# EAGLE design FlashPanelV6_2 (EAGLE 7.7.0)
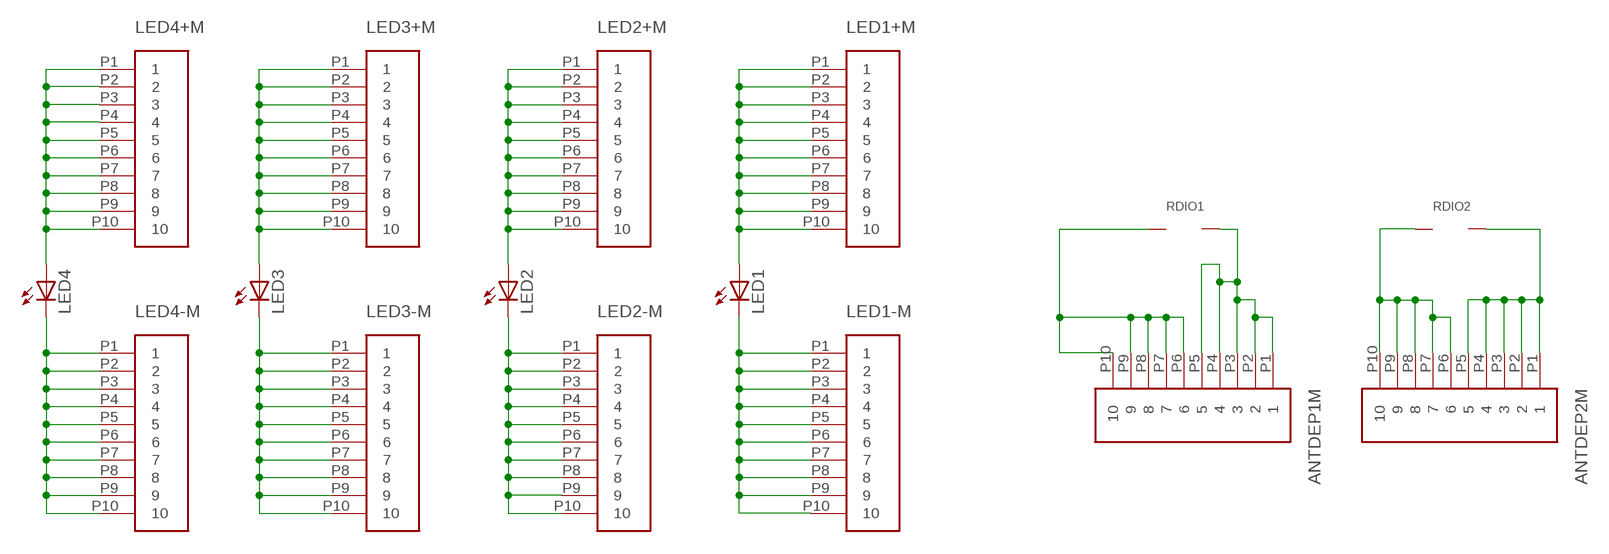
[diagram p0: schematic, sheet 1, part 1 of 2]
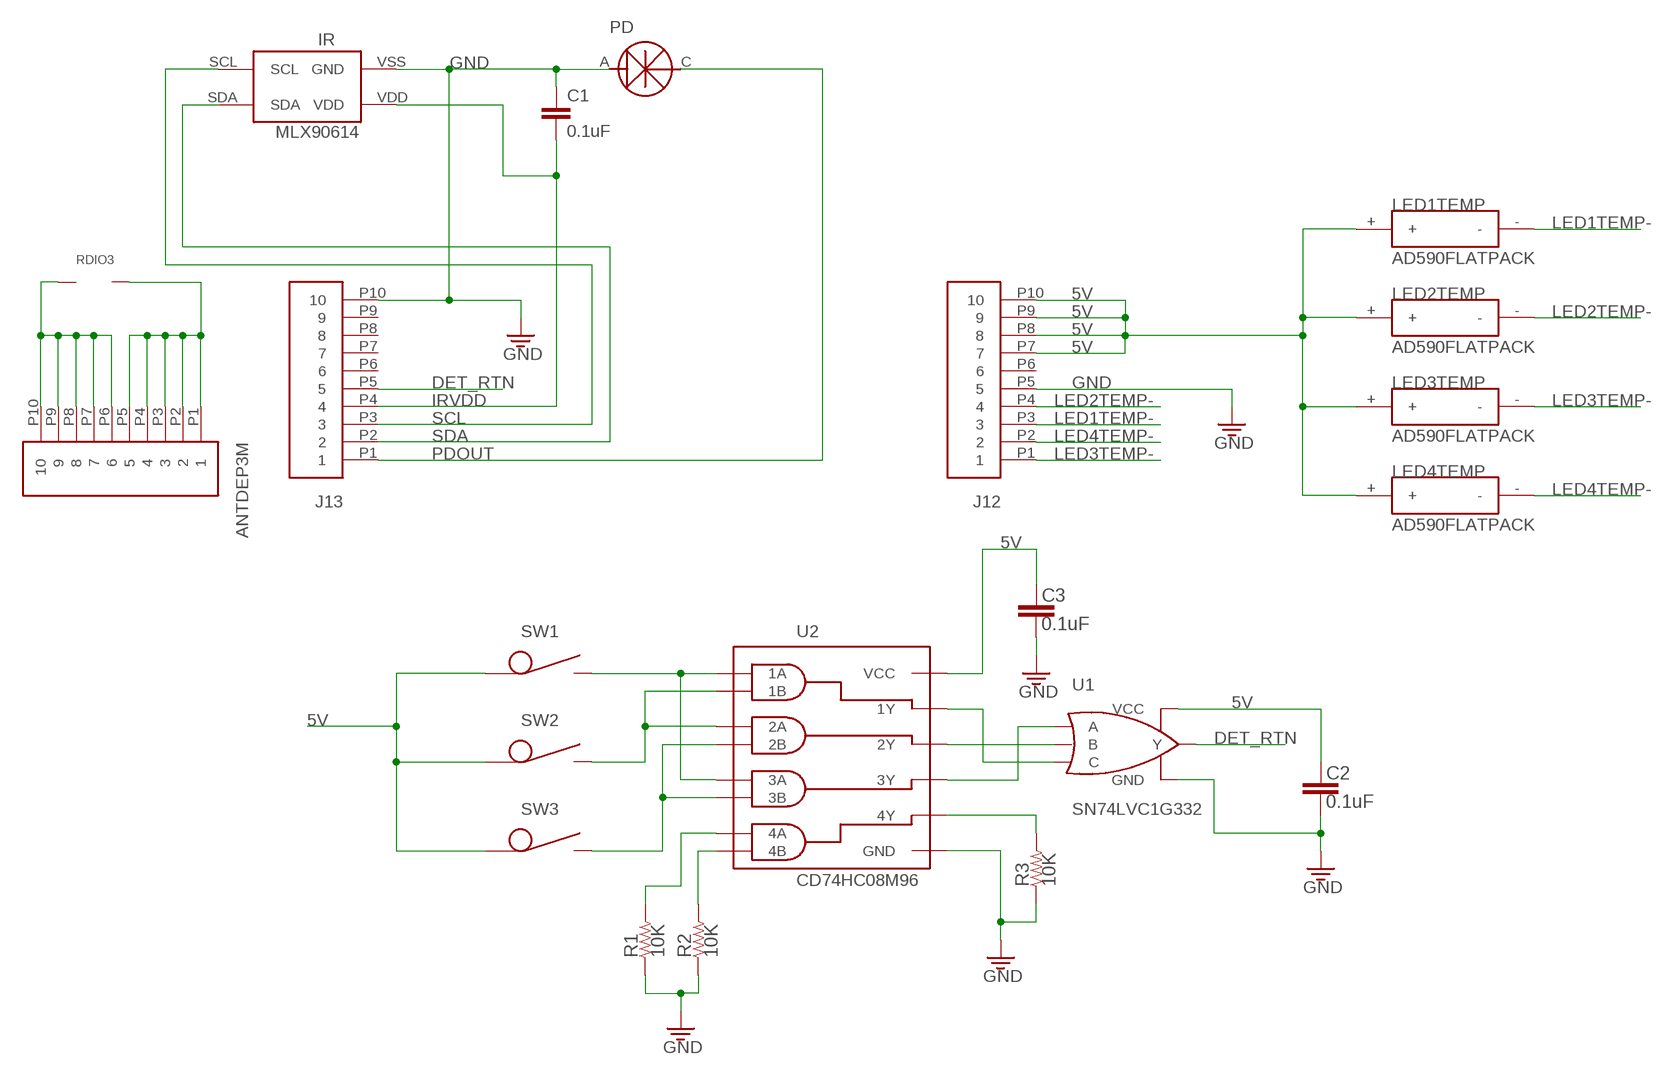
[diagram p1: schematic, sheet 1, part 2 of 2]

## Parts
ANTDEP1M  10PINMALE  [10PINMALE]
ANTDEP2M  10PINMALE  [10PINMALE]
ANTDEP3M  10PINMALE  [10PINMALE]
C1  0.1uF  CAP0805  [0805]
C2  0.1uF  CAP0805  [0805]
C3  0.1uF  CAP0805  [0805]
IR  MXL90614  [MXL90620]
J12  10PINMALE  [10PINMALE]
J13  10PINMALE  [10PINMALE]
LED1  CXM27  [CXM27]
LED1+M  10PINMALE  [10PINMALE]
LED1-M  10PINMALE  [10PINMALE]
LED1TEMP  AD590FLATPACK  [FLATPACK]
LED2  CXM27  [CXM27]
LED2+M  10PINMALE  [10PINMALE]
LED2-M  10PINMALE  [10PINMALE]
LED2TEMP  AD590FLATPACK  [FLATPACK]
LED3  CXM27  [CXM27]
LED3+M  10PINMALE  [10PINMALE]
LED3-M  10PINMALE  [10PINMALE]
LED3TEMP  AD590FLATPACK  [FLATPACK]
LED4  CXM27  [CXM27]
LED4+M  10PINMALE  [10PINMALE]
LED4-M  10PINMALE  [10PINMALE]
LED4TEMP  AD590FLATPACK  [FLATPACK]
PD  TEMD6200  [TEMD6200]
R1  10K  RES0805  [0805]
R2  10K  RES0805  [0805]
R3  10K  RES0805  [0805]
RDIO1  RDIO  [RDIO_DPLY]
RDIO2  RDIO  [RDIO_DPLY]
RDIO3  RDIO  [RDIO_DPLY]
SW1  SW-DETECT  [SW-SPRING]
SW2  SW-DETECT  [SW-SPRING]
SW3  SW-DETECT  [SW-SPRING]
U1  SN74LVC1G332  [DCK-6]
U2  CD74HC08M96  [SOIC-14]

## Nets
5V: C2.1 C3.1 J12.P7 J12.P8 J12.P9 J12.P10 LED1TEMP.+ LED2TEMP.+ LED3TEMP.+ LED4TEMP.+ SW1.P$1 SW2.P$1 SW3.P$1 U1.P$5(VCC) U2.P$14(VCC)
DET_RTN: J13.P5 U1.P$4(Y)
GND: C1.1 C2.2 C3.2 IR.VSS(GND) J12.P5 J13.P10 PD.A R1.1 R2.1 R3.1 U1.P$2(GND) U2.P$7(GND)
IRVDD: C1.2 IR.VDD J13.P4
LED1M: LED1-M.P1 LED1-M.P2 LED1-M.P3 LED1-M.P4 LED1-M.P5 LED1-M.P6 LED1-M.P7 LED1-M.P8 LED1-M.P9 LED1-M.P10 LED1.CATHODE(C)
LED1P: LED1+M.P1 LED1+M.P2 LED1+M.P3 LED1+M.P4 LED1+M.P5 LED1+M.P6 LED1+M.P7 LED1+M.P8 LED1+M.P9 LED1+M.P10 LED1.ANODE(A)
LED1TEMP-: J12.P3 LED1TEMP.-
LED2M: LED2-M.P1 LED2-M.P2 LED2-M.P3 LED2-M.P4 LED2-M.P5 LED2-M.P6 LED2-M.P7 LED2-M.P8 LED2-M.P9 LED2-M.P10 LED2.CATHODE(C)
LED2P: LED2+M.P1 LED2+M.P2 LED2+M.P3 LED2+M.P4 LED2+M.P5 LED2+M.P6 LED2+M.P7 LED2+M.P8 LED2+M.P9 LED2+M.P10 LED2.ANODE(A)
LED2TEMP-: J12.P4 LED2TEMP.-
LED3M: LED3-M.P1 LED3-M.P2 LED3-M.P3 LED3-M.P4 LED3-M.P5 LED3-M.P6 LED3-M.P7 LED3-M.P8 LED3-M.P9 LED3-M.P10 LED3.CATHODE(C)
LED3P: LED3+M.P1 LED3+M.P2 LED3+M.P3 LED3+M.P4 LED3+M.P5 LED3+M.P6 LED3+M.P7 LED3+M.P8 LED3+M.P9 LED3+M.P10 LED3.ANODE(A)
LED3TEMP-: J12.P1 LED3TEMP.-
LED4M: LED4-M.P1 LED4-M.P2 LED4-M.P3 LED4-M.P4 LED4-M.P5 LED4-M.P6 LED4-M.P7 LED4-M.P8 LED4-M.P9 LED4-M.P10 LED4.CATHODE(C)
LED4P: LED4+M.P1 LED4+M.P2 LED4+M.P3 LED4+M.P4 LED4+M.P5 LED4+M.P6 LED4+M.P7 LED4+M.P8 LED4+M.P9 LED4+M.P10 LED4.ANODE(A)
LED4TEMP-: J12.P2 LED4TEMP.-
N$1: U1.P$6(C) U2.P$3(1Y)
N$2: U1.P$3(B) U2.P$6(2Y)
N$3: U1.P$1(A) U2.P$8(3Y)
N$4: SW1.P$2 U2.P$1(1A) U2.P$9(3A)
N$5: SW2.P$2 U2.P$2(1B) U2.P$4(2A)
N$6: SW3.P$2 U2.P$5(2B) U2.P$10(3B)
N$7: R2.2 U2.P$13(4B)
N$8: R1.2 U2.P$12(4A)
N$16: R3.2 U2.P$11(4Y)
PDOUT: J13.P1 PD.C
RDIO1+: ANTDEP1M.P6 ANTDEP1M.P7 ANTDEP1M.P8 ANTDEP1M.P9 ANTDEP1M.P10 RDIO1.P3 RDIO1.P4
RDIO1-: ANTDEP1M.P1 ANTDEP1M.P2 ANTDEP1M.P3 ANTDEP1M.P4 ANTDEP1M.P5 RDIO1.P1 RDIO1.P2
RDIO2+: ANTDEP2M.P6 ANTDEP2M.P7 ANTDEP2M.P8 ANTDEP2M.P9 ANTDEP2M.P10 RDIO2.P3 RDIO2.P4
RDIO2-: ANTDEP2M.P1 ANTDEP2M.P2 ANTDEP2M.P3 ANTDEP2M.P4 ANTDEP2M.P5 RDIO2.P1 RDIO2.P2
RDIO3+: ANTDEP3M.P6 ANTDEP3M.P7 ANTDEP3M.P8 ANTDEP3M.P9 ANTDEP3M.P10 RDIO3.P3 RDIO3.P4
RDIO3-: ANTDEP3M.P1 ANTDEP3M.P2 ANTDEP3M.P3 ANTDEP3M.P4 ANTDEP3M.P5 RDIO3.P1 RDIO3.P2
SCL: IR.SCL J13.P3
SDA: IR.SDA J13.P2
Unconnected: J12.P6 J13.P6 J13.P7 J13.P8 J13.P9

## Library data of the parts
ANTDEP1M ANTDEP2M ANTDEP3M J12 J13 LED1+M LED1-M LED2+M LED2-M LED3+M LED3-M LED4+M LED4-M = chm27:10PINMALE
C1 = CNTRL_BOARD:CAP: Capacitor Standard 0603 ceramic capacitor, and 0.1" leaded capacitor.
C2 C3 = BrownSpaceEngineering:CAP: Capacitor Standard 0603 ceramic capacitor, and 0.1" leaded capacitor.
IR = CNTRL_BOARD:MXL90614
LED1-LED4 = chm27:CXM27
LED1TEMP LED2TEMP LED3TEMP LED4TEMP = BrownSpaceEngineering:AD590
PD = BrownSpaceEngineering:TEMD6200
R1-R3 = BrownSpaceEngineering:RES
RDIO1-RDIO3 = rdio_deploy:RDIO
SW1-SW3 = BrownSpaceEngineering:SW-DETECT
U1 = BrownSpaceEngineering:SN74LVC1G332
U2 = BrownSpaceEngineering:CD74HC08M96

## Board
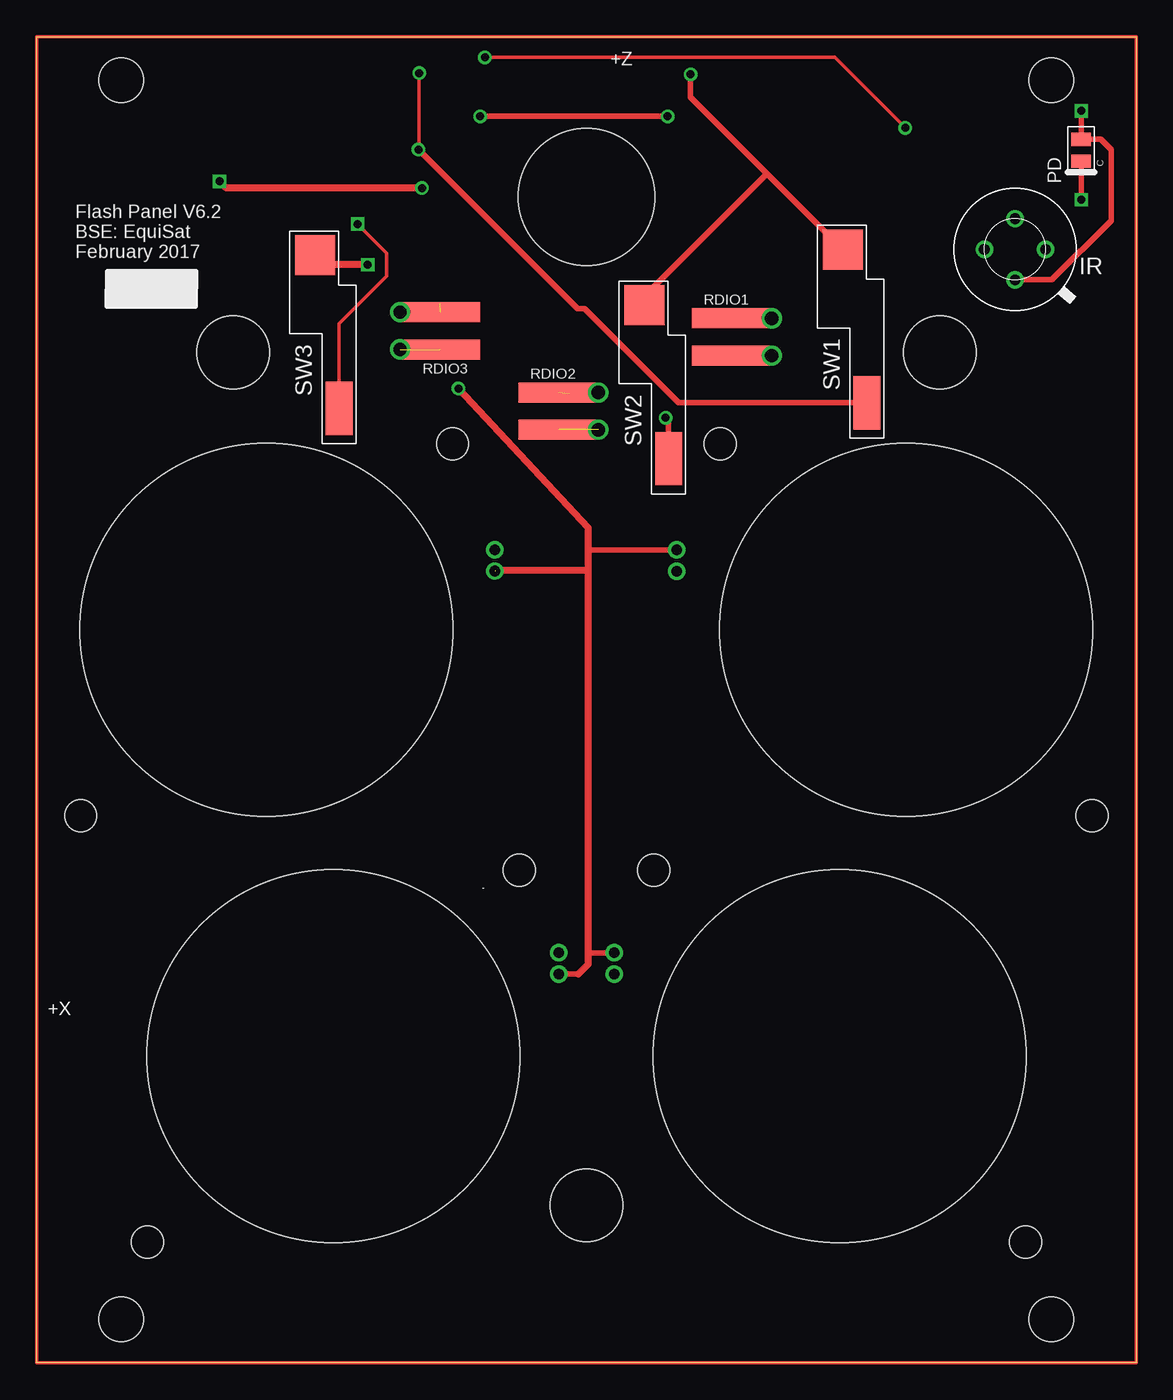
[diagram p2: board, top side]
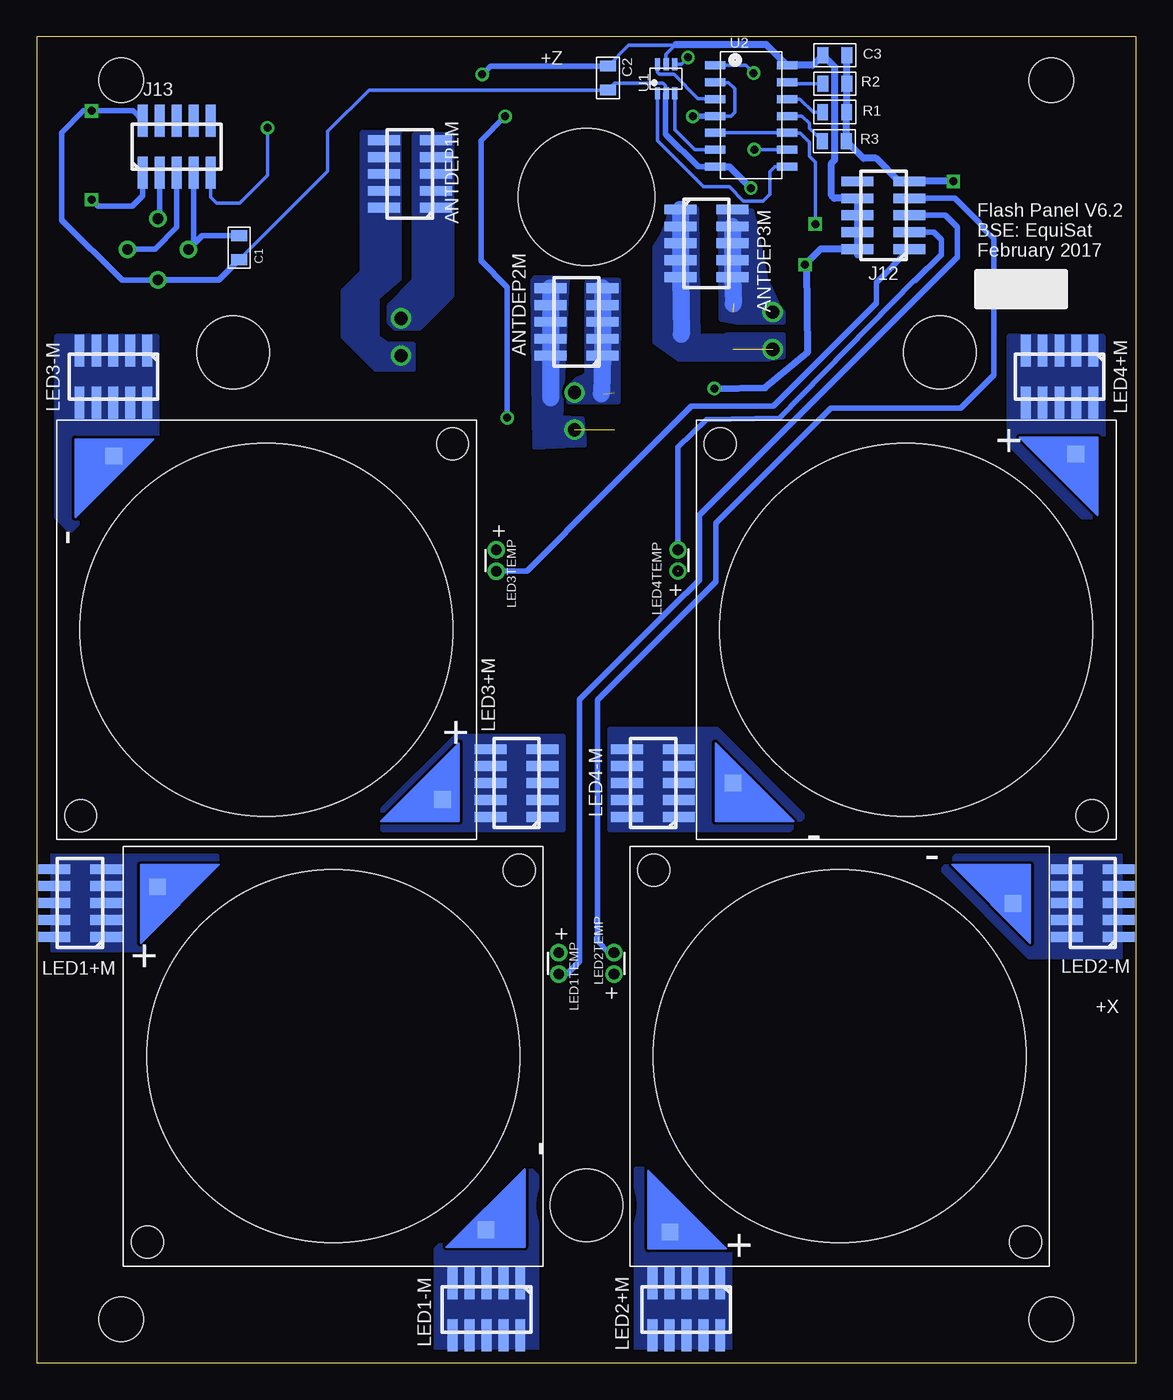
[diagram p3: board, bottom side, seen from below]

Size 82.5 x 99.5 mm. Coordinates in mm from the lower left corner, seen from the top.
Outline: 0,0 0,99.5 82.5,99.5 82.5,0 0,0
Copper layers (1*16): Top 0.035mm / dielectric 1.5mm / Bottom 0.035mm
Design rules "default": minimum track width 10mil, minimum drill 24mil, track to track 8mil, track to pad 8mil, pad to pad 8mil, via to via 8mil, smd to smd 8mil, copper to edge 40mil, drill to drill 8mil, minimum pad ring 10mil, minimum via ring 8mil, stop-mask expansion 4mil, vias tented up to drill 0mil, thermal gap 10mil
Holes 3.35 mm at 76.15,3.25 76.15,96.25 6.35,96.25 6.35,3.25
Holes 5.46 mm at 41.25,11.81 67.77,75.82 14.73,75.82
Holes 10.26 mm at 41.25,87.48

### Footprints (pad centres in the part's own frame; a part is rotated, then mirrored left to right if it is on the bottom)
10PINMALE = smd 0.74 x 2.4: P1 -2.54,-1.95; P2 -1.27,-1.95; P3 0,-1.95; P4 1.27,-1.95; P5 2.54,-1.95; P6 2.54,1.95; P7 1.27,1.95; P8 0,1.95; P9 -1.27,1.95; P10 -2.54,1.95
0805 = smd 0.8 x 1.2: 1 -0.9,0; 2 0.9,0
MXL90620 = drill 0.8: SCL 2.293,0; VDD -2.293,0; VSS 0,-2.294 | drill 0.8 pad 1.2: SDA 0,2.294
CXM27 = smd 1.27 x 1.27 bottom: ANODE 12.725,-13.191; CATHODE -13.017,11.481 | hole 27.991: 0,0 | hole 2.4: 13.95,13.95; -13.95,-13.95
FLATPACK = drill 0.8: + -0.8,0; - 0.8,0
TEMD6200 = smd 1 x 1.45: A 0.76,0.4; C -0.88,0.4
RDIO_DPLY = smd 1.5 x 6: P1 -2.8,-3; P4 0,-3 | drill 1: P2 -2.794,0; P3 0,0
SW-SPRING = smd 3 x 3: P$1 -4.62,-0.5 | smd 4 x 2: P$2 6.89,1.31
DCK-6 = smd 0.4 x 0.9: P$1 -0.65,-1.1; P$2 0,-1.1; P$3 0.65,-1.1; P$4 0.65,1.1; P$5 0,1.1; P$6 -0.65,1.1
SOIC-14 = smd 0.6 x 1.55: P$1 0,0; P$2 1.27,0; P$3 2.54,0; P$4 3.81,0; P$5 5.08,0; P$6 6.35,0; P$7 7.62,0; P$8 7.62,5.4; P$9 6.35,5.4; P$10 5.08,5.4; P$11 3.81,5.4; P$12 2.54,5.4; P$13 1.27,5.4; P$14 0,5.4

### Placement (x,y rotation side)
ANTDEP1M  54.5,89.2 90 bottom
ANTDEP2M  42,78.1 90 bottom
ANTDEP3M  32.25,84 270 bottom
C1  67.31,83.67 90 bottom
C2  39.65,96.4 270 bottom
C3  22.61,98.12 0 bottom
IR  73.41,83.55 0 top
J12  18.95,86.1 90 bottom
J13  72,91.25 0 bottom
LED1  60.25,23 90 top
LED1+M  79.25,34.5 90 bottom
LED1-M  48.75,4 180 bottom
LED1TEMP  43.33,29.96 270 bottom
LED2  22.25,23 0 top
LED2+M  33.75,4 180 bottom
LED2-M  3.25,34.5 90 bottom
LED2TEMP  39.18,29.97 90 bottom
LED3  65.25,55 270 top
LED3+M  46.5,43.5 90 bottom
LED3-M  76.75,74 180 bottom
LED3TEMP  48.02,60.19 270 bottom
LED4  17.25,55 180 top
LED4+M  5.75,74 180 bottom
LED4-M  36.25,43.5 90 bottom
LED4TEMP  34.38,60.21 90 bottom
PD  78.78,91.04 90 top
R1  22.61,93.85 180 bottom
R2  22.6,95.98 180 bottom
R3  22.64,91.65 180 bottom
RDIO1  55.15,75.57 270 top
RDIO2  42.14,70.01 270 top
RDIO3  27.27,78.83 90 top
SW1  60.99,78.92 270 top
SW2  46.1,74.73 270 top
SW3  21.38,78.49 270 top
U1  35.27,96.35 0 bottom
U2  31.6,97.36 270 bottom

### Tracks (layer width: path | path; a pad name or v marks a point on that pad's centre or on a via)
5V  (via drill 0.6)  (1 unrouted)
  Top 0.406: v49.07,96.67 49.07,94.95 54.79,89.23 | 54.79,89.23 SW1.P$1 | 41.42,60.99 LED3TEMP.+ | SW2.P$1 45.6,80.05 54.79,89.23 | LED1TEMP.+ 41.4,30.76 41.4,30.79 | 40.65,29.17 LED2TEMP.+
  Top 0.508: v24.84,82.4 21.59,82.4 SW3.P$1 | 40.65,29.17 41.4,29.92 41.4,30.79 | 41.4,30.79 41.4,59.49 | 41.4,59.49 41.4,61.01 | 41.4,61.01 41.4,62.64 v31.65,73.1 | 34.41,59.44 41.35,59.44 41.4,59.49 | 41.42,30.76 41.4,30.79 | 41.42,60.99 41.4,61.01
  Bottom 0.254: 34.54,98.91 34.59,98.86 | 34.59,98.86 35.27,98.18 U1.P$5 | C2.1 38.08,98.86 34.59,98.86
  Bottom 0.406: C2.1 48.45,97.3 v49.07,96.67
  Bottom 0.508: 34.54,98.91 27.75,98.91 U2.P$14 24.27,97.36 C3.1 22.61,97.22 22.61,90.27 22.86,90.02 22.86,87.58 22.65,87.37 J12.P7 J12.P8 J12.P9 J12.P10 | J12.P10 20.9,83.14 SW3.P$1 20.88,83.54 J12.P10 | J12.P10 23.68,83.56 v24.84,82.4 24.69,82.25 24.64,75.84 27.84,73.15 v31.65,73.1
DET_RTN  (via drill 0.6)
  Top 0.254: v33.63,97.94 59.89,97.94 v65.18,92.66
  Bottom 0.254: U1.P$4 34.12,97.45 v33.63,97.94 | v65.18,92.66 65.18,89.1 67.26,87.02 68.99,87.02 69.44,87.48 69.44,89.28 J13.P5
GND  (via drill 0.6)
  Top 0.406: IR.VSS 76.18,81.26 80.62,85.7 80.62,91.03 79.85,91.8 PD.A 78.38,91.75 v78.38,93.93
  Top 0.508: v28.91,88.14 14.22,88.14 v13.72,88.65
  Bottom 0.254: 35.31,95.21 35.31,95.81 35.51,96.01 39.13,96.01 C2.2 57.56,95.5 60.66,92.41 60.66,89.43 C1.1
  Bottom 0.406: IR.VSS 68.83,81.26 C1.1 68.85,81.23 76.1,81.23 80.62,85.75 80.62,92.3 78.99,93.93 v78.38,93.93 75.27,93.93 J13.P10 | U2.P$7 32.84,89.74 35.31,92.2 35.31,95.21 U1.P$2 35.26,95.26
  Bottom 0.508: C3.2 R2.1 21.71,95.97 R1.1 21.74,93.83 R3.1 20.46,90.37 19.51,90.37 17.77,88.64 J12.P5 v13.72,88.65 | U2.P$7 30.51,89.74 v28.91,88.14
IRVDD
  Bottom 0.406: C1.2 70.09,84.57 IR.VDD 70.73,83.94 J13.P4
LED1M
  pour Bottom (no thermals): 46,15 52.5,8.5 52.5,0.5 45,0.5 45,14
LED1P
  pour Bottom (no thermals): 82.5,38 69,38 69,36.5 74.5,31 82,31 82.5,31
LED1TEMP-
  Bottom 0.406: LED1TEMP.- 42.72,29.16 41.76,30.12 41.76,49.78 33.83,57.71 33.78,57.71 32.77,58.73 32.77,63.6 13.41,82.96 13.41,85.19 14.33,86.11 J12.P3
LED2M
  pour Bottom (no thermals): 14.5,37 8,30.5 0,30.5 0,38 13.5,38
LED2P
  pour Bottom (no thermals): 37.5,1 37.5,14.5 36,14.5 30.5,9 30.5,1.5 30.5,1
LED2TEMP-
  Bottom 0.406: J12.P4 13.61,87.37 11.79,85.55 11.79,85.5 11.38,85.09 11.38,85.04 10.67,84.33 10.67,74.12 13.16,71.63 22.91,71.63 31.55,62.99 31.55,58.62 40.44,49.73 40.44,31.65 39.55,30.77 LED2TEMP.-
LED3M
  pour Bottom (no thermals): 80,62.5 73.5,69 73.5,77 81,77 81,63.5
LED3P
  pour Bottom (no thermals): 43,40 56.5,40 56.5,41.5 51,47 43.5,47 43,47
LED3TEMP-
  Bottom 0.406: LED3TEMP.- 45.72,59.39 42.77,62.33 42.77,62.38 33.38,71.78 27.23,71.78 19.51,79.5 19.51,81.05 J12.P1
LED4M
  pour Bottom (no thermals): 25,41 31.5,47.5 39.5,47.5 39.5,40 26,40
LED4P
  pour Bottom (no thermals): 2.5,77 2.5,63.5 4,63.5 9.5,69 9.5,76.5 9.5,77
LED4TEMP-
  Bottom 0.406: LED4TEMP.- 34.38,68.69 32.26,70.76 26.77,70.87 16.66,81.18 16.61,81.18 14.63,83.16 14.63,84.28 15.19,84.84 J12.P2
N$1
  Bottom 0.254: U1.P$6 35.92,96.83 35.76,96.67 34.7,96.67 32.87,94.84 31.62,94.84 U2.P$3
N$2
  Bottom 0.254: U2.P$6 33.1,91.01 34.59,92.51 34.59,95.23 U1.P$3
N$3
  Bottom 0.254: U2.P$8 27.1,89.74 27.48,89.36 27.48,87.68 27.99,87.17 29.46,87.17 30.53,88.24 32.46,88.24 35.92,91.69 U1.P$1
N$4  (via drill 0.6)
  Top 0.254: v28.7,96.77 28.7,91.08 v28.65,91.03
  Top 0.406: SW1.P$2 48.16,72.03 41.1,79.1 40.59,79.1 v28.65,91.03
  Bottom 0.254: U2.P$1 29.29,97.36 v28.7,96.77 | v28.65,91.03 26.22,91.03 U2.P$9
N$5  (via drill 0.6)
  Top 0.406: SW2.P$2 47.41,70.7 v47.19,70.92 | v47.35,93.52 v33.27,93.52
  Bottom 0.254: U2.P$4 30.4,93.55 30.12,93.83 30.12,95.61 30.58,96.06 31.57,96.06 U2.P$2
  Bottom 0.406: v47.19,70.92 47.19,80.72 49.17,82.7 49.17,91.69 v47.35,93.52 | v33.27,93.52 31.62,93.52 U2.P$4
N$6  (via drill 0.6)
  Top 0.254: SW3.P$2 22.69,77.96 26.26,81.53 26.26,83.26 v24.08,85.45
  Bottom 0.254: v24.08,85.45 24.08,90.07 24.54,90.53 24.54,91.59 25.2,92.25 26.17,92.25 U2.P$10 U2.P$5
N$7
  Bottom 0.254: U2.P$13 26.09,95.98 R2.2
N$8
  Bottom 0.254: U2.P$12 25.22,94.82 24.23,93.83 23.54,93.83 R1.2
N$9
  Top 0.254: 0,99.5 82.5,99.5 82.5,0 0,0 0,99.5
N$16
  Bottom 0.254: U2.P$11 25.07,93.55 24.54,93.02 24.54,92.65 R3.2
PDOUT  (via drill 0.6)
  Top 0.406: v78.38,87.27 PD.C
  Bottom 0.406: J13.P1 74.54,87.56 75.34,86.77 77.88,86.77 v78.38,87.27
RDIO1+
  Top 0.406: RDIO1.P4 RDIO1.P3
  pour Bottom (rank 5, no thermals): 54.25,76.4 54.25,74.57 57.05,74.57 59.49,77.01 59.49,80.42 58.06,81.84 58.06,92.3 55.32,92.3 55.32,81.33 56.95,79.91 56.95,76.96 56.18,76.4
RDIO1-
  Top 0.406: RDIO1.P1 RDIO1.P2
  pour Bottom (no thermals): 51.36,92.15 51.36,80.11 53.85,77.62 55.58,77.62 56.03,78.08 56.03,79.3 54.15,81.18 54.15,92.15
RDIO2+  (1 unrouted)
  Bottom 1.27: ANTDEP2M.P6 ANTDEP2M.P7 ANTDEP2M.P8 ANTDEP2M.P9 ANTDEP2M.P10 43.93,72.4
  pour Bottom (rank 4, no thermals): 42.7,81.3 43.2,70.9 41.6,70.8 41.4,68.9 45.1,68.7 45.2,73.8 45.25,81.2 45.1,81.4 42.9,81.4
RDIO2-  (1 unrouted)
  Bottom 0.406: 39.96,72.7 40.13,72.69
  Bottom 1.27: ANTDEP2M.P5 ANTDEP2M.P4 ANTDEP2M.P3 ANTDEP2M.P2 ANTDEP2M.P1 40.13,72.69
  pour Bottom (no thermals): 38.86,81.2 38.9,72.11 42.56,72.11 42.6,73.1 41.9,73.8 41.4,74 41.2,74.2 41.2,80.94 41.1,81.25
RDIO3+  (1 unrouted)
  Bottom 1.27: ANTDEP3M.P9 ANTDEP3M.P8 ANTDEP3M.P7 ANTDEP3M.P6 30.24,79.46
  pour Bottom (no thermals): 31.1,78.3 29.9,78.1 26.5,78.1 26.5,78.8 26.7,79 27,79.5 27.8,81.3 28.55,85.12 28.86,86.39 31.2,86.7 31.2,86.5
RDIO3-  (1 unrouted)
  Bottom 1.27: ANTDEP3M.P1 ANTDEP3M.P2 ANTDEP3M.P3 ANTDEP3M.P4 ANTDEP3M.P5 34.14,77.17
  pour Bottom (no thermals): 32.9,76.2 32.7,77 30.8,77 30.7,77.1 26.5,77.1 26.5,75.5 27.7,75.3 34.3,75.3 36.1,76.6 36.1,84.2 35.2,86.8 33,86.6
SCL
  Bottom 0.406: IR.SCL 73.62,83.55 71.98,85.19 71.98,89.28 J13.P3
SDA
  Bottom 0.406: IR.SDA 73.27,85.98 J13.P2

### Text on the board
tPlace: +Z | +X
bPlace: +Z | +X
tNames: Flash Panel V6.2 / BSE: EquiSat / February 2017
bNames: Flash Panel V6.2 / BSE: EquiSat / February 2017
tDocu: EQUiSat | Brown Space Engineering